# Altium schematic sheet PSU_MAX1806_ADJ.SchDoc: Power Supply MAX1806 ADJ
size A4; Organization: Altium Limited.; Address1: Level 3, 12a Rodborough Rd; Address2: Frenchs Forest 2086; Address3: NSW; Address4: AUSTRALIA; SheetNumber: 1; SheetTotal: 100; PageSetup: Record=PageOptions|CenterHorizontal=True|CenterVertical=True|PrintScale=1.39|XCorrection=1.00|YCorrection=1.00|PrintKind=1|BorderSize=5000000|LeftOffset=0|BottomOffset=0|Orientation=2|PaperLength=1000|PaperWidth=1000|Scale=100|PaperSource=7|PrintQuality=1200|MediaType=1|DitherType=10|PaperKind=A3 (297 x 420 mm)|PrintScaleMode=1
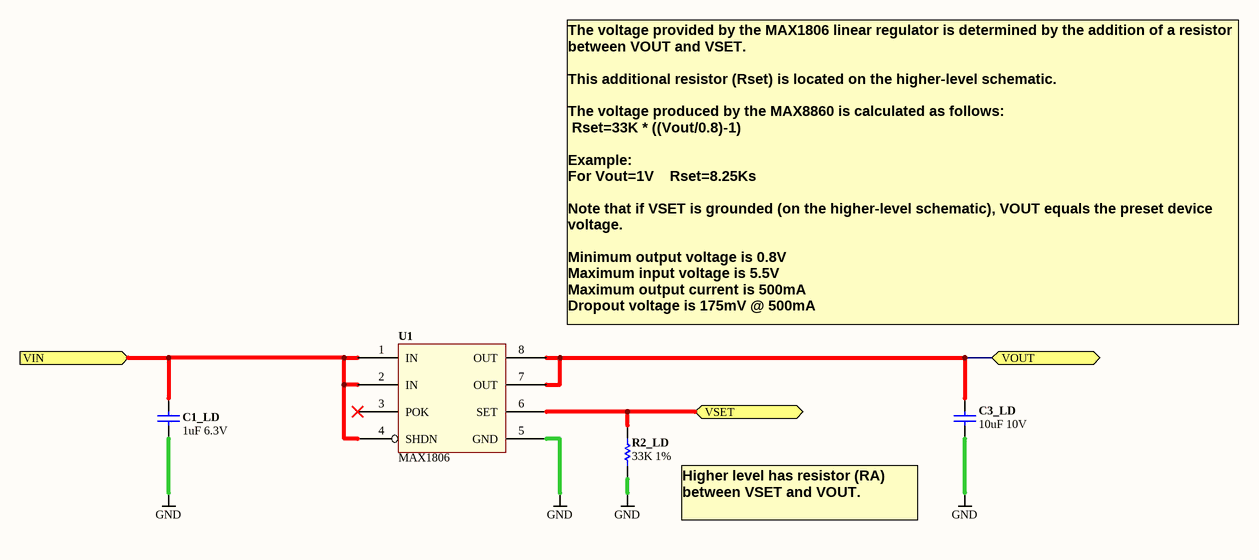
[diagram p0: PSU_MAX1806_ADJ.SchDoc]

## Parts
C1_LD  1uF 6.3V  [CAPC1005-STAR]
C3_LD  10uF 10V  [CAPC2012-STAR]
R2_LD  33K 1%  [RESC1005-STAR]
U1  MAX1806  [SOP65P490-8]

## Ports
VIN (in), VOUT (bidir), VSET (bidir)

## Nets
GND: C1_LD.2 C3_LD.2 R2_LD.2 U1.5(GND)
VIN: C1_LD.1 U1.1(IN) U1.2(IN) U1.4(SHDN) ; port VIN
VOUT: C3_LD.1 U1.7(OUT) U1.8(OUT) ; port VOUT
VSET: R2_LD.1 U1.6(SET) ; port VSET

Not connected (* = marked no-connect by the designer): U1 3(POK)*

## Notes on the sheet
- The voltage provided by the MAX1806 linear regulator is determined by the addition of a resistor between VOUT and VSET.
  This additional resistor (Rset) is located on the higher-level schematic.
  The voltage produced by the MAX8860 is calculated as follows:
  Rset=33K * ((Vout/0.8)-1)
  Example:
  For Vout=1V    Rset=8.25Ks
  Note that if VSET is grounded (on the higher-level schematic), VOUT equals the preset device voltage.
  Minimum output voltage is 0.8V
  Maximum input voltage is 5.5V
  Maximum output current is 500mA
  Dropout voltage is 175mV @ 500mA
- Higher level has resistor (RA) between VSET and VOUT.
- Sheet Title
- Project Title
- Size:
- Date:
- A4
- Assy:
- Time:
- Revision:
- Sheet
- of
- File:

## Library data of the parts
C1_LD = D-101-0082: Capacitor, Ceramic, 1uF 10% 6.3V 0402 (1005) X5R; Polarity: Non-Polarized; Capacitance: 1 uF; Dielectric: X5R; Mounting Technology: Surface Mount; Rated Voltage: 6.3 V; Status: Unreleased; Technology: None; Tolerance: 10 %; Category: Capacitor
C3_LD = D-101-0087: Capacitor, Ceramic, 10uF 10% 10V 0805 (2012) X5R; Polarity: Non-Polarized; Capacitance: 10 uF; Dielectric: X5R; Mounting Technology: Surface Mount; Rated Voltage: 10 V; Status: Unreleased; Technology: None; Tolerance: 10 %; Category: Capacitor
R2_LD = D-100-0103: Resistor, 33K 1% 0402 (1005); Power Rating: 63 mW; Mounting Technology: Surface Mount; Resistance: 33 K; Status: Production; Tolerance: 1 %; Category: Resistor
U1 = D-204-0013: MAX1806, 500mA Linear Regulator; Max Input Voltage: 5.5 V; Max Output Voltage: mV; Min Input Voltage: 2.25 V; Min Output Voltage: 0.8 V; Max Output Current: 500 mA; Mounting Technology: Surface Mount; Status: Production; Supply Voltage: mV; Category: IC-Power